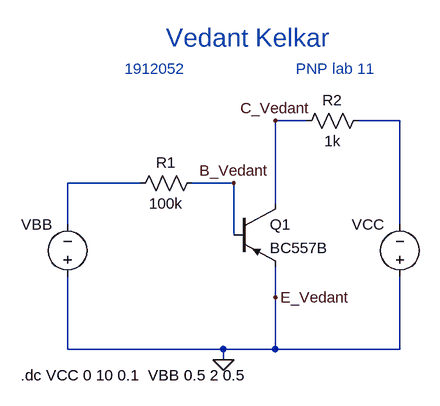
[diagram p0: schematic Draft29.asc]
Draft29.asc, the LTspice schematic file:
Version 4
SHEET 1 1340 680
WIRE 448 -16 400 -16
WIRE 592 -16 528 -16
WIRE 192 80 80 80
WIRE 336 80 272 80
WIRE 400 112 400 -16
WIRE 80 144 80 80
WIRE 592 144 592 -16
WIRE 336 160 336 80
WIRE 400 256 400 208
WIRE 80 336 80 224
WIRE 320 336 80 336
WIRE 400 336 400 256
WIRE 400 336 320 336
WIRE 592 336 592 224
WIRE 592 336 400 336
WIRE 320 352 320 336
FLAG 320 352 0
FLAG 336 80 B_Vedant
FLAG 400 -16 C_Vedant
FLAG 400 256 E_Vedant
SYMBOL voltage 80 240 R180
WINDOW 0 24 96 Left 2
WINDOW 3 24 16 Left 2
WINDOW 123 0 0 Left 0
WINDOW 39 0 0 Left 0
SYMATTR InstName VBB
SYMATTR Value ""
SYMBOL voltage 592 240 R180
WINDOW 0 24 96 Left 2
WINDOW 3 24 16 Left 2
WINDOW 123 0 0 Left 0
WINDOW 39 0 0 Left 0
SYMATTR InstName VCC
SYMATTR Value ""
SYMBOL res 288 64 R90
WINDOW 0 0 56 VBottom 2
WINDOW 3 32 56 VTop 2
SYMATTR InstName R1
SYMATTR Value 100k
SYMBOL res 544 -32 R90
WINDOW 0 0 56 VBottom 2
WINDOW 3 32 56 VTop 2
SYMATTR InstName R2
SYMATTR Value 1k
SYMBOL pnp 336 112 R0
SYMATTR InstName Q1
SYMATTR Value BC557B
TEXT 232 -144 Left 4 ;Vedant Kelkar
TEXT 168 -96 Left 2 ;1912052
TEXT 432 -96 Left 2 ;PNP lab 11
TEXT 8 376 Left 2 !.dc VCC 0 10 0.1  VBB 0.5 2 0.5

The netlist it stands for:
* Draft29.asc
VBB 0 N002
VCC 0 N001
R1 B_Vedant N002 100k
R2 N001 C_Vedant 1k
Q1 C_Vedant B_Vedant 0 0 BC557B
.model NPN NPN
.model PNP PNP
.lib standard.bjt
* Vedant Kelkar
* 1912052
* PNP lab 11
.dc VCC 0 10 0.1  VBB 0.5 2 0.5
.backanno
.end